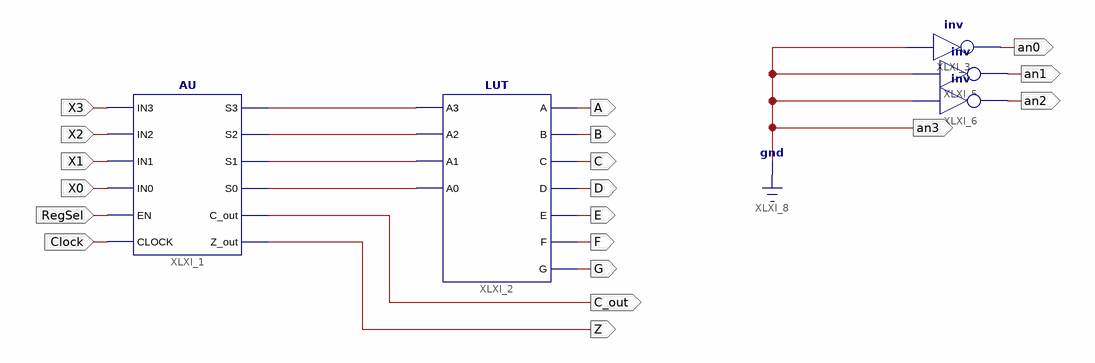
[diagram p0: schematic sheet 1]
// Xilinx ISE schematic AU_7_seg.sch (spartan3e) as structural Verilog: 5 symbols, 19 ports
module AU_7_seg (
  input  X3,
  input  X2,
  input  X1,
  input  X0,
  input  RegSel,
  input  Clock,
  output C_out,
  output Z,
  output A,
  output B,
  output C,
  output D,
  output E,
  output F,
  output G,
  output an3,
  output an0,
  output an1,
  output an2
);

  wire XLXN_1, XLXN_2, XLXN_4, XLXN_5;

  AU XLXI_1 (
    .CLOCK(Clock), .C_out(C_out), .EN(RegSel), .IN0(X0), .IN1(X1), .IN2(X2), .IN3(X3), .S0(XLXN_5),
    .S1(XLXN_4), .S2(XLXN_2), .S3(XLXN_1), .Z_out(Z));
  LUT XLXI_2 (.A(A), .A0(XLXN_5), .A1(XLXN_4), .A2(XLXN_2), .A3(XLXN_1), .B(B), .C(C), .D(D), .E(E), .F(F), .G(G));
  not XLXI_3 (an0, 1'b0);
  not XLXI_5 (an1, 1'b0);
  not XLXI_6 (an2, 1'b0);

  assign an3 = 1'b0;
endmodule
